# Altium schematic sheet io_sensor.SchDoc
size OrCAD A; DrawnBy: Van Tuan Ngo; Organization: PIF Club; Address1: HCMUT,; Address2: Ly Thuong Kiet St.,; Address3: District 10, HCM, VN; DocumentNumber: 3; Revision: 1.0.0; SheetNumber: 3; SheetTotal: 4; Project: RTLS
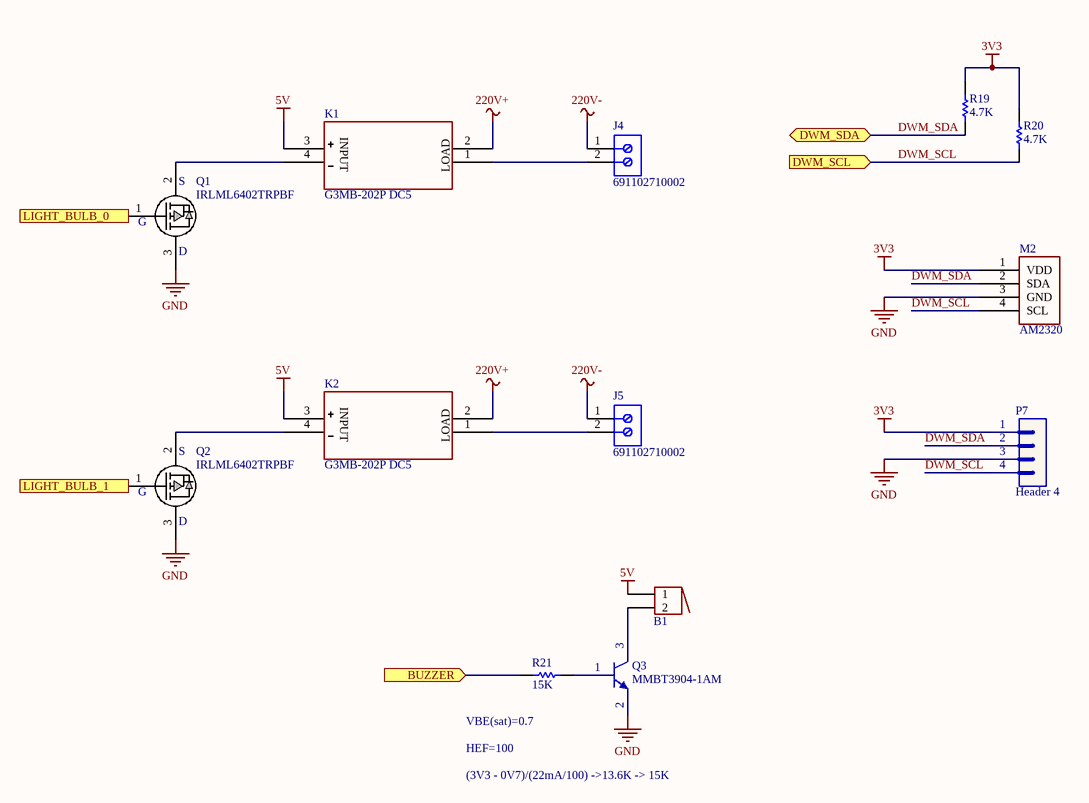
[diagram p0: io_sensor.SchDoc]

## Parts
B1  Buzzer  [BUZZER]  (value not drawn)
J4  691102710002  [691102710002]
J5  691102710002  [691102710002]
K1  G3MB-202P DC5  [G3MB]
K2  G3MB-202P DC5  [G3MB]
M2  AM2320  [AM2320]
P7  Header 4  [JP4]
Q1  IRLML6402TRPBF  [SOT23_NEX]
Q2  IRLML6402TRPBF  [SOT23_NEX]
Q3  MMBT3904-1AM  [SOT23_NEX]
R19  value 4.7K  [RES-SM-0805]  (hidden comment: Res-4.7K-0805)
R20  value 4.7K  [RES-SM-0805]  (hidden comment: Res-4.7K-0805)
R21  value 15K  [RES-SM-0805]  (hidden comment: Res-15K-0805)

## Ports
BUZZER (in), DWM_SCL (in), DWM_SDA (bidir), LIGHT_BULB_0 (in), LIGHT_BULB_1 (in)

## Nets
3V3: M2.1(VDD) P7.1 R19.2 R20.2
5V: B1.1 K1.3 K2.3
220V+: K1.2 K2.2
220V-: J4.1 J5.1
GND: M2.3(GND) P7.3 Q1.3(D) Q2.3(D) Q3.2(E)
BUZZER: R21.1 ; port BUZZER
DWM_SCL: M2.4(SCL) P7.4 R20.1 ; port DWM_SCL
DWM_SDA: M2.2(SDA) P7.2 R19.1 ; port DWM_SDA
LIGHT_BULB_0: Q1.1(G) ; port LIGHT_BULB_0
LIGHT_BULB_1: Q2.1(G) ; port LIGHT_BULB_1
NetB1_2: B1.2 Q3.3(C)
NetJ4_2: J4.2 K1.1
NetJ5_2: J5.2 K2.1
NetK1_4: K1.4 Q1.2(S)
NetK2_4: K2.4 Q2.2(S)
NetQ3_1: Q3.1(B) R21.2

## Notes on the sheet
- (near R21) VBE(sat)=0.7
- HEF=100
- (3V3 - 0V7)/(22mA/100) ->13.6K -> 15K
- Project
- Revision
- Date
- Author
- Sheet
- Time
- of
- File
- (in symbol G3MB-202P DC5) INPUT; LOAD

## Library data of the parts
J4 J5 = 691102710002: WR-TBL Serie 102 Horizontal Entry Modular, Pressure Clamp, pitch 5mm, 2p; Compliance: Lead free / RoHS; Modularity: Yes; PCB/Cable/Panel: PCB; Pin Number: 2; Rated Current [UL]: 15A; Working Voltage [UL]: 250VAC; ComponentLink1Description: Manufacturer; ComponentLink1URL: http://www.we-online.de; ComponentLink2URL: https://katalog.we-online.de/em/datasheet/691102710002.pdf; ComponentLink2Description: Datasheet; Mounting Technology: THT; Part Number: 691102710002; Packaging: Box; Operating Temperature: -40 to +105degC; Pitch: 5mm; Published Date: October 2019; Type: Horizontal; Publisher: Wurth Elektronik; Application: Pressure Clamp
K1 K2 = G3MB-202P DC5: 5VDC-220VAC Solid State Relay; Vendor: Omron; Built_By: EMA_Cory; SourceLibrary: Omron_2020-03-27_1; Datasheet: https://media.digikey.com/pdf/Data%20Sheets/Omron%20PDFs/G3MB.pdf; Manufacturer_Part_Number: G3MB-202P DC5; Copyright: Copyright (C) 2018 Accelerated Designs. All rights reserved; RefDes: RefDes; Type: DEV
P7 = Header 4: Header, 4-Pin; LatestRevisionDate: 17-Jul-2002; LatestRevisionNote: Re-released for DXP Platform.; Publisher: Altium Limited; Local Supplier: thegioiic; Local Supplier Part Number: x; Local Supplier Link: https://www.thegioiic.com/products/hang-rao-duc-don-2-54mm-40-chan-1-hang-cao-11-4mm-xuyen-lo
Q1 Q2 = IRLML6402TRPBF: P-Channel 20V 3.7A (Ta) 1.3W (Ta) Surface Mount Micro3™/SOT-23; Local Supplier: thegioiic; Local Supplier Link: https://www.thegioiic.com/products/irlml6402trpbf; Local Supplier Part Number: *
R19 R20 = Res-4.7K-0805: RES SMD 4.7K OHM 5% 1/8W 0805; Manufacturer: Yageo; Manufacturer Part Number: RC0805JR-074K7L; Local Supplier: thegioiic; Local Supplier Link: https://www.thegioiic.com/products/dien-tro-4-7-kohm-0805-5; Supplier 1: Digikey; Supplier 1 Link: https://www.digikey.com/product-detail/en/yageo/RC0805JR-074K7L/311-4.7KARCT-ND/731274; Supplier 1 Part Number: 311-4.7KARCT-ND
R21 = Res-15K-0805: RES 15K OHM 1% 1/4W 0805; Manufacturer: TE Connectivity Passive Product; Manufacturer Part Number: CRGCQ0805F15K; Local Supplier: thegioiic; Local Supplier Link: https://www.thegioiic.com/products/dien-tro-15-kohm-0805-5; Supplier 1: Digikey; Supplier 1 Part Number: A129763CT-ND; Supplier 1 Link: https://www.digikey.com/product-detail/en/te-connectivity-passive-product/CRGCQ0805F15K/A129763CT-ND/8577595
B1 = Buzzer: Local Supplier: thegioiic; Local Supplier Link: https://www.thegioiic.com/products/1209-dip-buzzer-12x9mm; Local Supplier Part Number: 1209 DIP Buzzer 12x9mm
Q3 = MMBT3904-1AM: Local Supplier: thegioiic; Local Supplier Link: https://www.thegioiic.com/products/mmbt3904-1am; Local Supplier Part Number: *